# EAGLE design A78 Maxi2 (EAGLE 7.7.0)
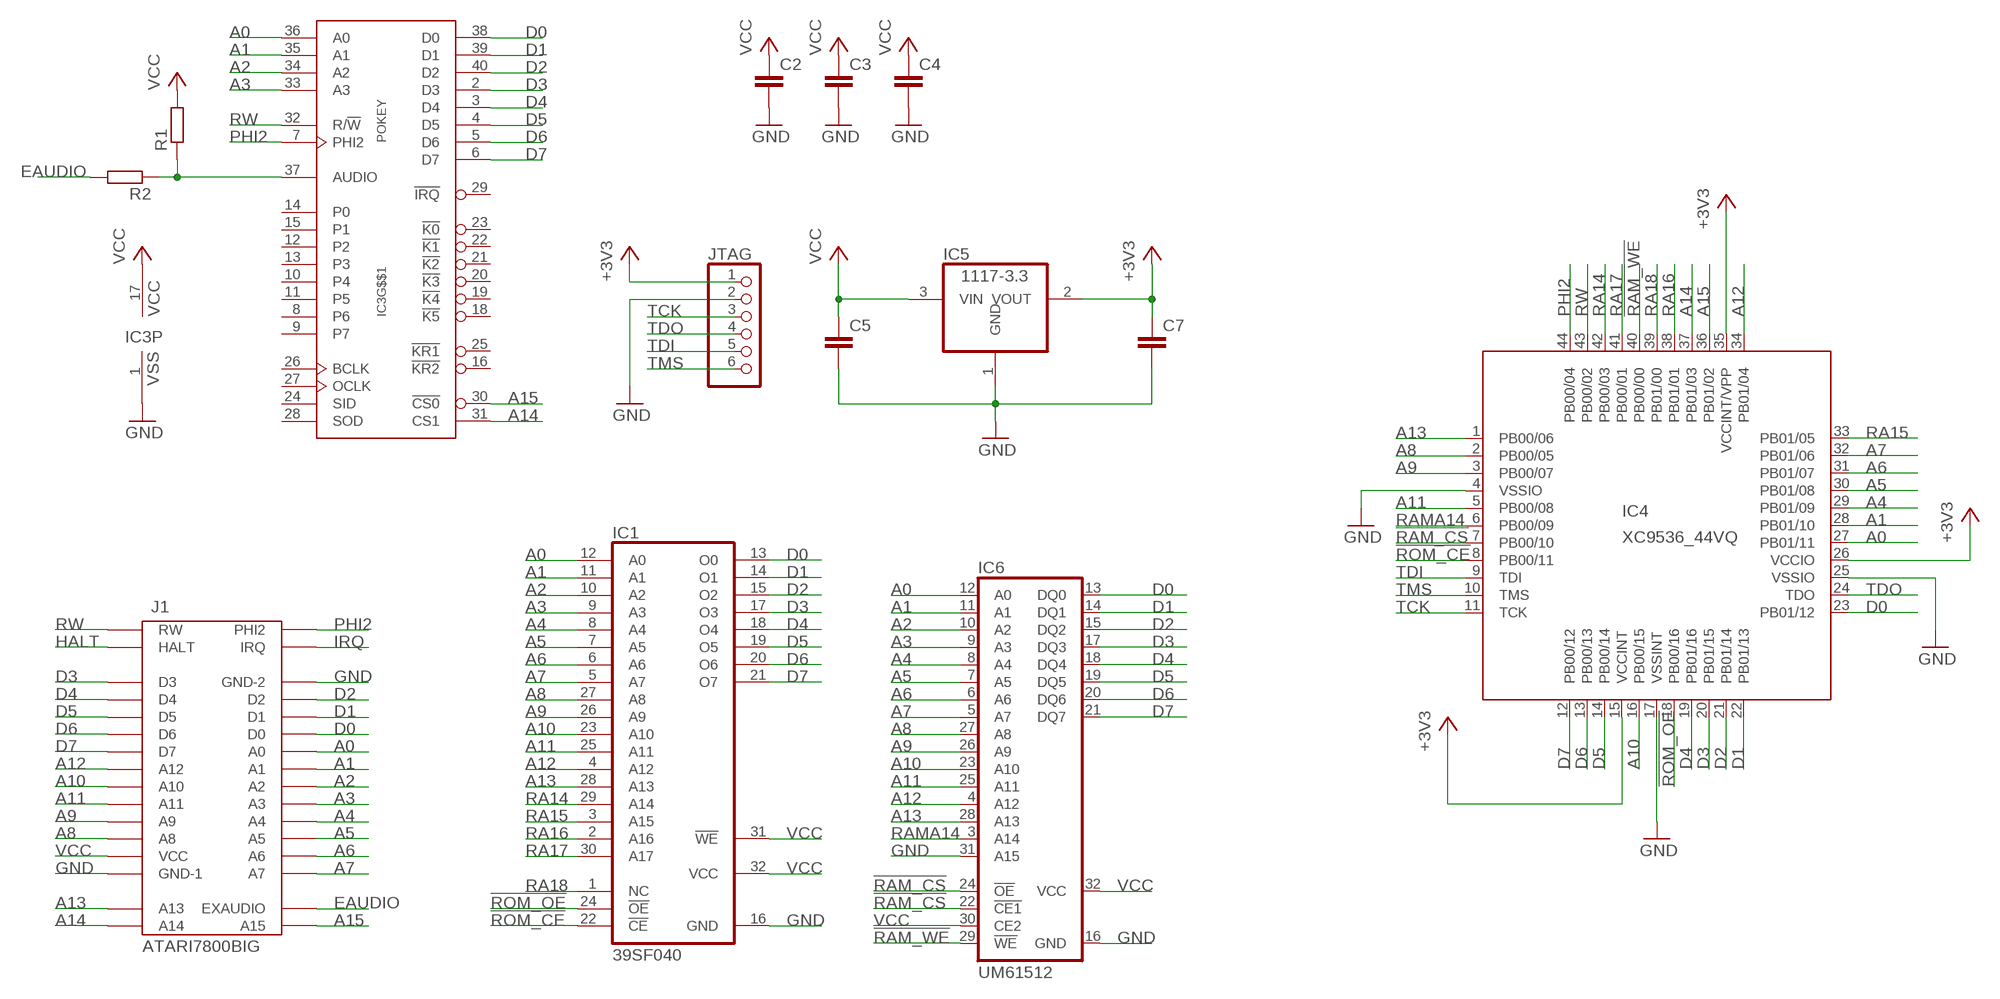
[diagram p0: schematic, sheet 1]

## Parts
C2  C-EU025-025X050  [C025-025X050]
C3  C-EUC0805  [C0805]
C4  C-EUC0805  [C0805]
C5  C-EUC0805  [C0805]
C7  C-EUC0805  [C0805]
IC1  39SF040  39SF020  [DIL32]
IC3  POKEY  [DIL40]
IC4  XC9536_44VQ  [SQFP-S-10X10-44]
IC5  1117-3.3  REG1117  [SOT223]
IC6  UM61512  [DIL32-NARROW]
J1  ATARI7800BIG  [ATARI-7800-BIG]
JTAG  PINHD-1X6  [1X06]
R1  R-EU_R0805  [R0805]
R2  R-EU_R0805  [R0805]

## Nets
!RAM_CS: IC4.7(PB00/10) IC6.22(!CE1) IC6.24(!OE)
!RAM_WE: IC4.40(PB00/00) IC6.29(!WE)
!ROM_CE: IC1.22(!CE) IC4.8(PB00/11)
!ROM_OE: IC1.24(!OE) IC4.18(PB00/16)
+3V3: C7.1 IC4.15(VCCINT) IC4.26(VCCIO) IC4.35(VCCINT/VPP) IC5.2(VOUT) JTAG.1
A0: IC1.12(A0) IC3.36(G$$1:A0) IC4.27(PB01/11) IC6.12(A0) J1.26(A0)
A1: IC1.11(A1) IC3.35(G$$1:A1) IC4.28(PB01/10) IC6.11(A1) J1.25(A1)
A2: IC1.10(A2) IC3.34(G$$1:A2) IC6.10(A2) J1.24(A2)
A3: IC1.9(A3) IC3.33(G$$1:A3) IC6.9(A3) J1.23(A3)
A4: IC1.8(A4) IC4.29(PB01/09) IC6.8(A4) J1.22(A4)
A5: IC1.7(A5) IC4.30(PB01/08) IC6.7(A5) J1.21(A5)
A6: IC1.6(A6) IC4.31(PB01/07) IC6.6(A6) J1.20(A6)
A7: IC1.5(A7) IC4.32(PB01/06) IC6.5(A7) J1.19(A7)
A8: IC1.27(A8) IC4.2(PB00/05) IC6.27(A8) J1.12(A8)
A9: IC1.26(A9) IC4.3(PB00/07) IC6.26(A9) J1.11(A9)
A10: IC1.23(A10) IC4.16(PB00/15) IC6.23(A10) J1.9(A10)
A11: IC1.25(A11) IC4.5(PB00/08) IC6.25(A11) J1.10(A11)
A12: IC1.4(A12) IC4.34(PB01/04) IC6.4(A12) J1.8(A12)
A13: IC1.28(A13) IC4.1(PB00/06) IC6.28(A13) J1.15(A13)
A14: IC3.31(G$$1:CS1) IC4.37(PB01/03) J1.16(A14)
A15: IC3.30(G$$1:!CS0) IC4.36(PB01/02) J1.17(A15)
D0: IC1.13(O0) IC3.38(G$$1:D0) IC4.23(PB01/12) IC6.13(DQ0) J1.27(D0)
D1: IC1.14(O1) IC3.39(G$$1:D1) IC4.22(PB01/13) IC6.14(DQ1) J1.28(D1)
D2: IC1.15(O2) IC3.40(G$$1:D2) IC4.21(PB01/14) IC6.15(DQ2) J1.29(D2)
D3: IC1.17(O3) IC3.2(G$$1:D3) IC4.20(PB01/15) IC6.17(DQ3) J1.3(D3)
D4: IC1.18(O4) IC3.3(G$$1:D4) IC4.19(PB01/16) IC6.18(DQ4) J1.4(D4)
D5: IC1.19(O5) IC3.4(G$$1:D5) IC4.14(PB00/14) IC6.19(DQ5) J1.5(D5)
D6: IC1.20(O6) IC3.5(G$$1:D6) IC4.13(PB00/13) IC6.20(DQ6) J1.6(D6)
D7: IC1.21(O7) IC3.6(G$$1:D7) IC4.12(PB00/12) IC6.21(DQ7) J1.7(D7)
EAUDIO: J1.18(EXAUDIO) R2.2
GND: C2.2 C3.2 C4.2 C5.2 C7.2 IC1.16(GND) IC3.1(P:VSS) IC4.4(VSSIO) IC4.17(VSSINT) IC4.25(VSSIO) IC5.1(GND) IC6.16(GND) IC6.31(A15) J1.14(GND-1) J1.30(GND-2) JTAG.2
HALT: J1.2(HALT)
IRQ: J1.31(IRQ)
N$1: IC3.37(G$$1:AUDIO) R1.1 R2.1
PHI2: IC3.7(G$$1:PHI2) IC4.44(PB00/04) J1.32(PHI2)
RA14: IC1.29(A14) IC4.42(PB00/03)
RA15: IC1.3(A15) IC4.33(PB01/05)
RA16: IC1.2(A16) IC4.38(PB01/01)
RA17: IC1.30(A17) IC4.41(PB00/01)
RA18: IC1.1(NC) IC4.39(PB01/00)
RAMA14: IC4.6(PB00/09) IC6.3(A14)
RW: IC3.32(G$$1:R/!W) IC4.43(PB00/02) J1.1(RW)
TCK: IC4.11(TCK) JTAG.3
TDI: IC4.9(TDI) JTAG.5
TDO: IC4.24(TDO) JTAG.4
TMS: IC4.10(TMS) JTAG.6
VCC: C2.1 C3.1 C4.1 C5.1 IC1.31(!WE) IC1.32(VCC) IC3.17(P:VCC) IC5.3(VIN) IC6.30(CE2) IC6.32(VCC) J1.13(VCC) R1.2
Unconnected: IC3.8(G$$1:P6) IC3.9(G$$1:P7) IC3.10(G$$1:P4) IC3.11(G$$1:P5) IC3.12(G$$1:P2) IC3.13(G$$1:P3) IC3.14(G$$1:P0) IC3.15(G$$1:P1) IC3.16(G$$1:!KR2) IC3.18(G$$1:!K5) IC3.19(G$$1:!K4) IC3.20(G$$1:!K3) IC3.21(G$$1:!K2) IC3.22(G$$1:!K1) IC3.23(G$$1:!K0) IC3.24(G$$1:SID) IC3.25(G$$1:!KR1) IC3.26(G$$1:BCLK) IC3.27(G$$1:OCLK) IC3.28(G$$1:SOD) IC3.29(G$$1:!IRQ)

## Library data of the parts
C2-C5 C7 = rcl:C-EU: CAPACITOR, European symbol
IC1 = 39SF020:39SF020
IC3 = eagle-6.5.0-atari:POKEY: POKEY
IC4 = xilinx-xc9:XC9536_44VQ: xc9536_pc44 XC9500 In-System Programmable CPLD Family Auto generated by make-symbol-device-package-bsdl.ulp Rev. 34 Source: xc9536_vq44.bsd; MPN: XC9536-15VQG44C; OC_FARNELL: 1193227; OC_NEWARK: 98K3377
IC5 = burr-brown:REG1117: 800mA and 1A Low Dropout (LDO) Positive Regulator 1.8V, 2.5V, 2.85V, 3.3V, 5V, and Adj; MPN: REG1117; OC_FARNELL: 1097566; OC_NEWARK: 14P6981
IC6 = eagle-6.5.0-atari:UM61512
J1 = eagle-6.5.0-atari:ATARI7800BIG
JTAG = adafruit:PINHD-1X6: PIN HEADER
R1 R2 = rcl:R-EU_: RESISTOR, European symbol

## Board
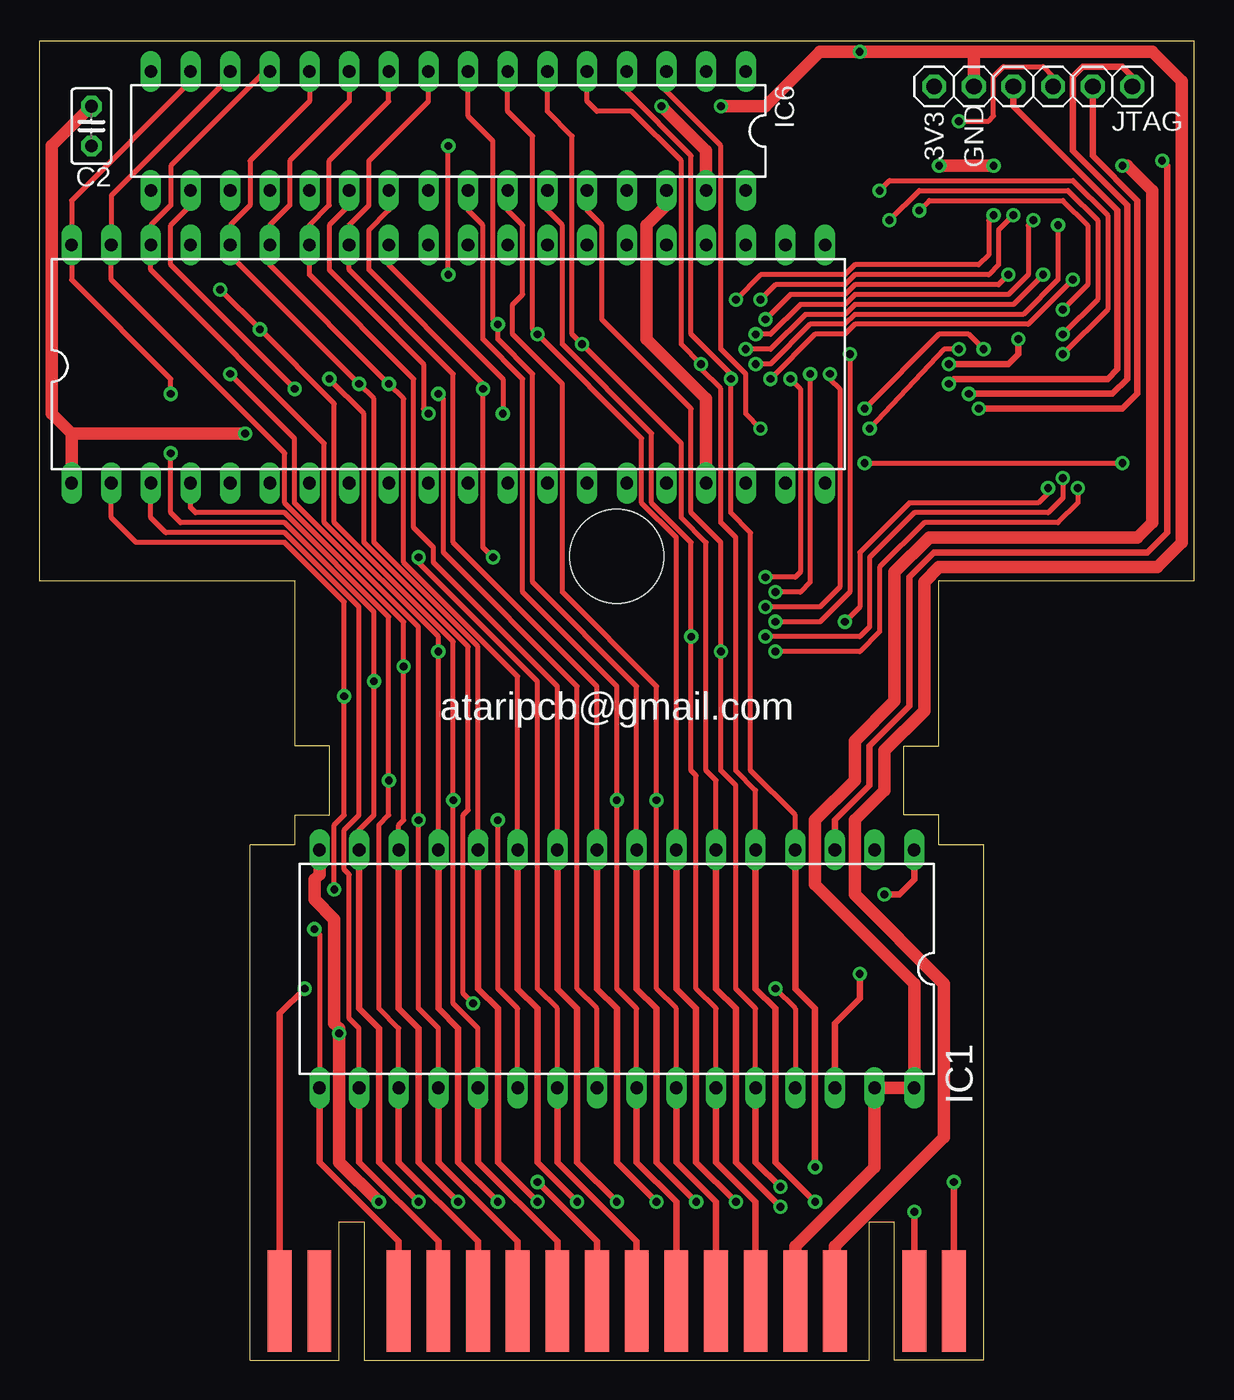
[diagram p1: board, top side]
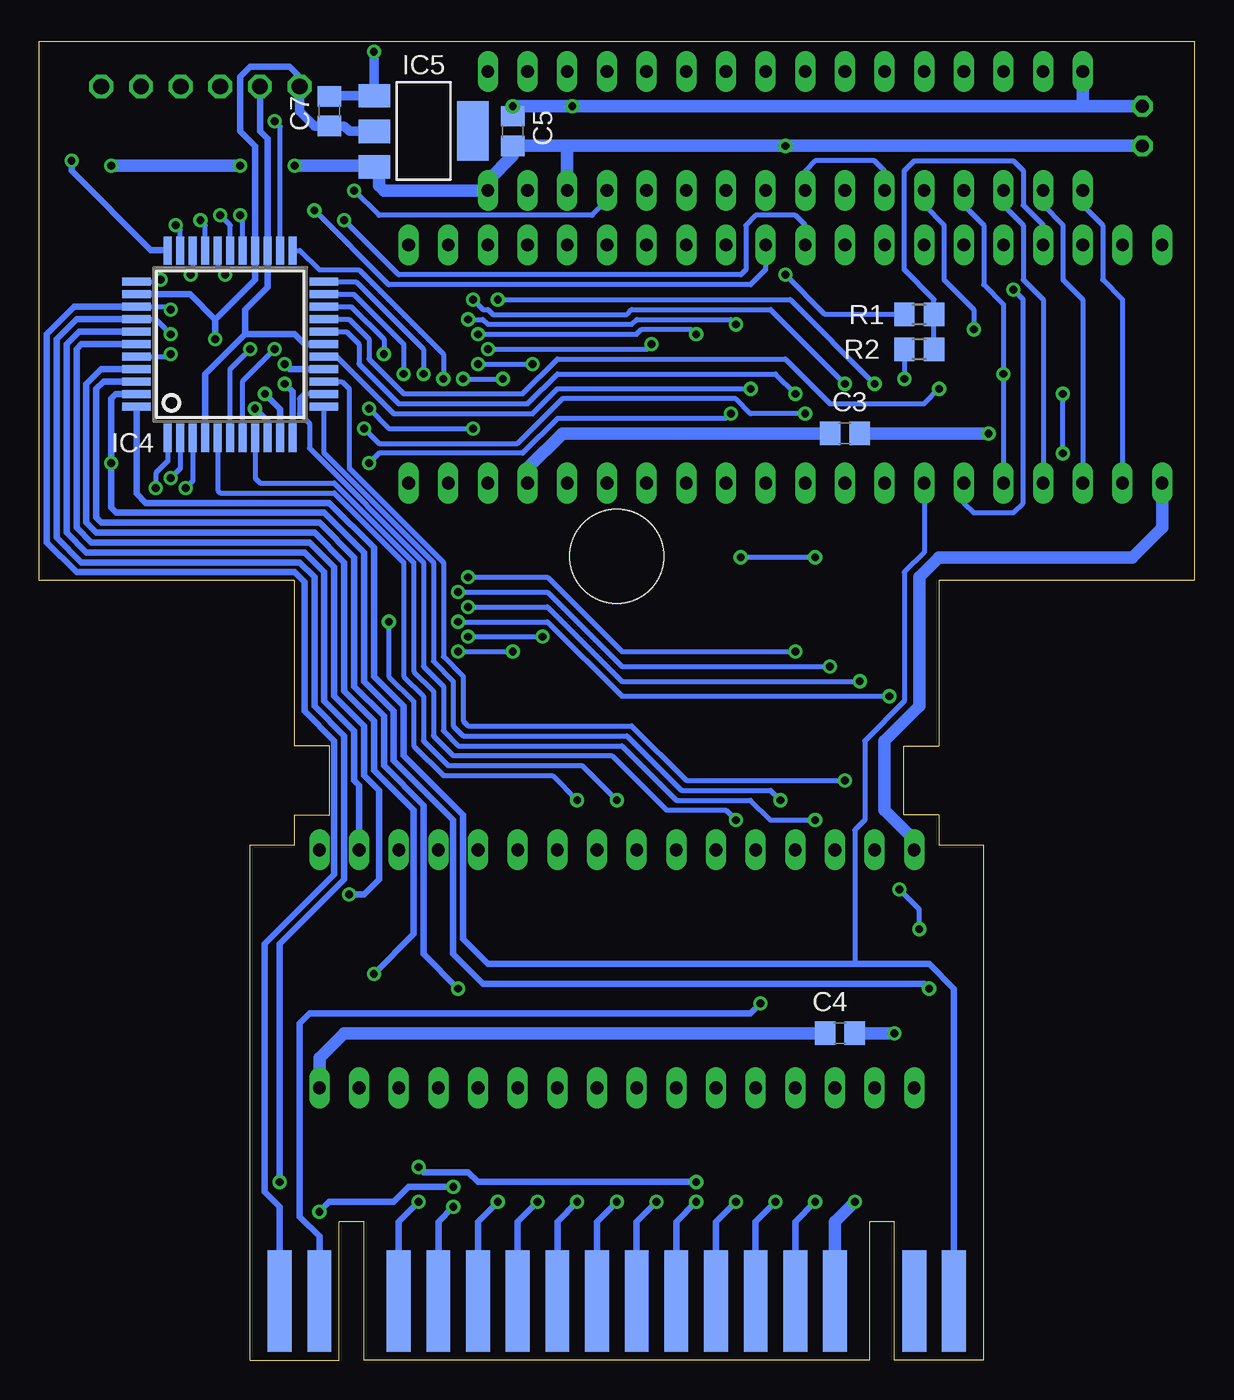
[diagram p2: board, bottom side, seen from below]

Size 74 x 84.5 mm. Coordinates in mm from the lower left corner, seen from the top.
Copper layers (1*16): Top 0.035mm / dielectric 1.5mm / Bottom 0.035mm
Design rules "default": minimum track width 10mil, minimum drill 24mil, track to track 8mil, track to pad 8mil, pad to pad 8mil, via to via 8mil, smd to smd 8mil, copper to edge 40mil, drill to drill 8mil, minimum pad ring 10mil, minimum via ring 8mil, stop-mask expansion 4mil, vias tented up to drill 0mil, thermal gap 10mil

### Footprints (pad centres in the part's own frame; a part is rotated, then mirrored left to right if it is on the bottom)
C025-025X050 = drill 0.813 octagon: 1 -1.27,0; 2 1.27,0
C0805 = smd 1.3 x 1.5: 1 -0.95,0; 2 0.95,0
DIL32 = drill 0.813 long: 1 -19.05,-7.62; 2 -16.51,-7.62; 3 -13.97,-7.62; 4 -11.43,-7.62; 5 -8.89,-7.62; 6 -6.35,-7.62; 7 -3.81,-7.62; 8 -1.27,-7.62; 9 1.27,-7.62; 10 3.81,-7.62; 11 6.35,-7.62; 12 8.89,-7.62; 13 11.43,-7.62; 14 13.97,-7.62; 15 16.51,-7.62; 16 19.05,-7.62; 17 19.05,7.62; 18 16.51,7.62; 19 13.97,7.62; 20 11.43,7.62; 21 8.89,7.62; 22 6.35,7.62; 23 3.81,7.62; 24 1.27,7.62; 25 -1.27,7.62; 26 -3.81,7.62; 27 -6.35,7.62; 28 -8.89,7.62; 29 -11.43,7.62; 30 -13.97,7.62; 31 -16.51,7.62; 32 -19.05,7.62
DIL40 = drill 0.813 long: 1 -24.13,-7.62; 2 -21.59,-7.62; 3 -19.05,-7.62; 4 -16.51,-7.62; 5 -13.97,-7.62; 6 -11.43,-7.62; 7 -8.89,-7.62; 8 -6.35,-7.62; 9 -3.81,-7.62; 10 -1.27,-7.62; 11 1.27,-7.62; 12 3.81,-7.62; 13 6.35,-7.62; 14 8.89,-7.62; 15 11.43,-7.62; 16 13.97,-7.62; 17 16.51,-7.62; 18 19.05,-7.62; 19 21.59,-7.62; 20 24.13,-7.62; 21 24.13,7.62; 22 21.59,7.62; 23 19.05,7.62; 24 16.51,7.62; 25 13.97,7.62; 26 11.43,7.62; 27 8.89,7.62; 28 6.35,7.62; 29 3.81,7.62; 30 1.27,7.62; 31 -1.27,7.62; 32 -3.81,7.62; 33 -6.35,7.62; 34 -8.89,7.62; 35 -11.43,7.62; 36 -13.97,7.62; 37 -16.51,7.62; 38 -19.05,7.62; 39 -21.59,7.62; 40 -24.13,7.62
SQFP-S-10X10-44 = smd 0.5 x 1.8: 1 -4,-6; 2 -3.2,-6; 3 -2.4,-6; 4 -1.6,-6; 5 -0.8,-6; 6 0,-6; 7 0.8,-6; 8 1.6,-6; 9 2.4,-6; 10 3.2,-6; 11 4,-6; 23 4,6; 24 3.2,6; 25 2.4,6; 26 1.6,6; 27 0.8,6; 28 0,6; 29 -0.8,6; 30 -1.6,6; 31 -2.4,6; 32 -3.2,6; 33 -4,6 | smd 1.8 x 0.5: 12 6,-4; 13 6,-3.2; 14 6,-2.4; 15 6,-1.6; 16 6,-0.8; 17 6,0; 18 6,0.8; 19 6,1.6; 20 6,2.4; 21 6,3.2; 22 6,4; 34 -6,4; 35 -6,3.2; 36 -6,2.4; 37 -6,1.6; 38 -6,0.8; 39 -6,0; 40 -6,-0.8; 41 -6,-1.6; 42 -6,-2.4; 43 -6,-3.2; 44 -6,-4
SOT223 = smd 1.499 x 2.007: 1 -2.261,-3.15; 2 0.025,-3.15; 3 2.311,-3.15 | smd 3.81 x 2.007: 4 0,3.15
DIL32-NARROW = drill 0.813 long: 1 -16.51,-3.81; 2 -13.97,-3.81; 3 -11.43,-3.81; 4 -8.89,-3.81; 5 -6.35,-3.81; 6 -3.81,-3.81; 7 -1.27,-3.81; 8 1.27,-3.81; 9 3.81,-3.81; 10 6.35,-3.81; 11 8.89,-3.81; 12 11.43,-3.81; 13 13.97,-3.81; 14 16.51,-3.81; 15 19.05,-3.81; 16 21.59,-3.81; 17 21.59,3.81; 18 19.05,3.81; 19 16.51,3.81; 20 13.97,3.81; 21 11.43,3.81; 22 8.89,3.81; 23 6.35,3.81; 24 3.81,3.81; 25 1.27,3.81; 26 -1.27,3.81; 27 -3.81,3.81; 28 -6.35,3.81; 29 -8.89,3.81; 30 -11.43,3.81; 31 -13.97,3.81; 32 -16.51,3.81
ATARI-7800-BIG = smd 1.524 x 6.477: 1 -21.59,3.81; 2 -19.05,3.81; 3 -13.97,3.81; 4 -11.43,3.81; 5 -8.89,3.81; 6 -6.35,3.81; 7 -3.81,3.81; 8 -1.27,3.81; 9 1.27,3.81; 10 3.81,3.81; 11 6.35,3.81; 12 8.89,3.81; 13 11.43,3.81; 14 13.97,3.81; 15 19.05,3.81; 16 21.59,3.81 | smd 1.524 x 6.477 bottom: 17 21.59,3.81; 18 19.05,3.81; 19 13.97,3.81; 20 11.43,3.81; 21 8.89,3.81; 22 6.35,3.81; 23 3.81,3.81; 24 1.27,3.81; 25 -1.27,3.81; 26 -3.81,3.81; 27 -6.35,3.81; 28 -8.89,3.81; 29 -11.43,3.81; 30 -13.97,3.81; 31 -19.05,3.81; 32 -21.59,3.81 | hole 6: 0,51.5
1X06 = drill 1.016 octagon: 1 -6.35,0; 2 -3.81,0; 3 -1.27,0; 4 1.27,0; 5 3.81,0; 6 6.35,0
R0805 = smd 1.3 x 1.5: 1 -0.95,0; 2 0.95,0

### Placement (x,y rotation side)
C2  3.34,79.06 90 top
C3  22.39,59.37 0 bottom
C4  22.71,20.96 0 bottom
C5  43.67,78.74 90 bottom
C7  55.41,80.01 90 bottom
IC1  37,25.08 180 top
IC3  26.2,63.82 0 top
IC4  61.77,65.09 0 bottom
IC5  49.38,78.74 270 bottom
IC6  28.74,78.74 180 top
J1  37,0 0 top
JTAG  63.67,81.6 0 top
R1  17.63,66.99 180 bottom
R2  17.63,64.77 180 bottom

### Tracks (layer width: path | path; a pad name or v marks a point on that pad's centre or on a via)
!RAM_CS  (via drill 0.5)
  Top 0.305: v58.91,64.77 57.95,64.77 v53.19,59.69 | IC6.22 19.86,73.98 18.59,72.71 18.59,69.85 24.62,63.82 24.62,60.96 v24.94,60.64
  Bottom 0.305: IC4.7 60.97,62.71 v58.91,64.77 | v53.19,59.69 52.24,58.74 43.35,58.74 40.49,61.59 29.38,61.59 28.43,60.64 v24.94,60.64 | IC6.22 19.86,76.2 20.49,76.84 24.3,76.84 24.94,76.2 IC6.24
!RAM_WE  (via drill 0.5)
  Top 0.305: v53.83,74.93 54.46,75.56 66.21,75.56 68.43,73.34 68.43,67.31 v65.58,64.45
  Bottom 0.305: IC6.29 37.63,74.3 38.59,73.34 52.24,73.34 v53.83,74.93 | IC4.40 65.74,64.29 v65.58,64.45
!ROM_CE  (via drill 0.5)
  Top 0.305: IC1.22 30.65,22.54 29.38,23.81 v29.38,34.61
  Bottom 0.305: IC4.8 60.16,56.5 59.86,56.2 55.1,56.2 50.02,51.12 50.02,44.13 48.75,42.86 48.75,40 47.48,38.73 37.32,38.73 33.83,35.24 30.02,35.24 v29.38,34.61
!ROM_OE  (via drill 0.5)
  Top 0.305: IC1.24 35.73,22.54 34.46,23.81 34.46,43.18 25.89,51.75 25.89,61.59 v25.57,61.91
  Bottom 0.305: IC4.18 54.31,65.89 53.51,65.09 53.51,63.82 50.97,61.28 42.72,61.28 40.81,63.18 26.84,63.18 v25.57,61.91
+3V3  (via drill 0.5)
  Top 0.406: v58.27,63.82 62.08,63.82 62.72,64.45 v62.72,65.41
  Bottom 0.406: IC4.15 57.95,63.5 58.26,63.8 | 58.26,63.8 58.28,63.8 v58.27,63.82 58.26,63.8 | v62.72,65.41 62.72,66.67 | 62.72,66.67 60.18,69.22 60.18,71.08 IC4.26 60.16,77.78 61.13,78.74 61.13,82.23 60.5,82.87 57.95,82.87 57.32,82.23 JTAG.1 | IC4.35 64.33,68.29 62.72,66.67
  Bottom 0.61: IC5.2 54.12,78.72 54.46,79.06 C7.1 56.37,79.06 57.32,80.01 JTAG.1
A0  (via drill 0.5)
  Top 0.305: IC1.12 28.11,45.72 21.44,52.39 21.44,61.59 v20.49,62.55 12.23,70.8 IC3.36 12.23,72.71 13.5,73.98 13.5,76.84 17.32,80.65 IC6.12 | v61.13,73.34 60.81,73.03 60.81,70.8 60.18,70.17 52.24,70.17 51.61,69.53 46.21,69.53 v44.62,67.95
  Top 0.406: v31.92,10.16 29.38,12.7 29.38,22.54 28.11,23.81 IC1.12
  Bottom 0.305: IC4.27 60.97,73.18 v61.13,73.34 | v44.62,67.95 25.89,67.95 v20.49,62.55
  Bottom 0.406: J1.26 33.19,8.89 v31.92,10.16
A1  (via drill 0.5)
  Top 0.305: IC1.11 30.65,43.81 23.35,51.12 23.35,61.59 v22.39,62.55 14.77,70.17 IC3.35 14.77,72.71 16.05,73.98 16.05,76.84 19.86,80.65 IC6.11 | v46.21,67.95 47.16,68.9 51.61,68.9 52.24,69.53 60.81,69.53 61.45,70.17 61.45,72.39 v62.4,73.34
  Top 0.406: v34.46,10.16 31.92,12.7 31.92,22.54 30.65,23.81 IC1.11
  Bottom 0.305: IC4.28 61.77,72.71 v62.4,73.34 | v46.21,67.95 45.57,67.31 45.26,67.31 44.94,66.99 36.37,66.99 36.05,67.31 27.16,67.31 v22.39,62.55
  Bottom 0.406: J1.25 35.73,8.89 v34.46,10.16
A2  (via drill 0.5)
  Top 0.305: IC1.10 33.19,43.18 25.25,51.12 25.25,52.07 23.98,53.34 23.98,62.87 17.32,69.53 IC3.34 17.32,72.71 18.59,73.98 18.59,76.84 22.39,80.65 IC6.10
  Top 0.406: v37,10.16 34.46,12.7 34.46,22.54 33.19,23.81 IC1.10
  Bottom 0.406: J1.24 38.27,8.89 v37,10.16
A3  (via drill 0.5)
  Top 0.305: IC1.9 35.73,43.18 26.52,52.39 26.52,63.18 19.86,69.85 IC3.33 19.86,72.71 21.12,73.98 21.12,76.84 24.94,80.65 IC6.9
  Top 0.406: v39.54,10.16 37,12.7 37,22.54 35.73,23.81 IC1.9
  Bottom 0.406: J1.23 40.81,8.89 v39.54,10.16
A4  (via drill 0.5)
  Top 0.305: IC1.8 38.27,43.18 31.6,49.85 31.6,63.18 29.38,65.41 v29.38,66.36 29.06,66.67 29.06,78.11 27.48,79.69 IC6.8 | v62.08,69.53 61.45,68.9 52.24,68.9 51.61,68.26 48.11,68.26 v46.52,66.67
  Top 0.406: v42.08,10.16 39.54,12.7 39.54,22.54 38.27,23.81 IC1.8
  Bottom 0.305: IC4.29 62.56,70.02 v62.08,69.53 | v46.52,66.67 45.57,66.67 45.26,66.36 36.05,66.36 35.73,66.67 29.7,66.67 v29.38,66.36
  Bottom 0.406: J1.22 43.35,8.89 v42.08,10.16
A5  (via drill 0.5)
  Top 0.305: IC1.7 40.81,52.7 38.59,54.93 38.59,59.05 v31.92,65.72 31.6,66.04 31.6,78.42 30.02,80.01 IC6.7 | v63.67,73.03 63.35,72.71 63.35,69.53 62.08,68.26 52.24,68.26 51.61,67.63 48.75,67.63 46.84,65.72 v45.89,65.72
  Top 0.406: v44.62,10.16 42.08,12.7 42.08,22.54 40.81,23.81 IC1.7
  Bottom 0.305: IC4.30 63.36,72.7 v63.67,73.03 | v45.89,65.72 35.73,65.72 35.41,66.04 32.24,66.04 v31.92,65.72
  Bottom 0.406: J1.21 45.89,8.89 v44.62,10.16
A6  (via drill 0.5)
  Top 0.305: IC1.6 43.35,37.15 42.72,37.78 42.72,52.39 41.13,53.97 41.13,58.74 v34.78,65.09 34.14,65.72 34.14,78.42 32.55,80.01 IC6.6 | v45.26,64.77 46.84,64.77 49.06,66.99 51.61,66.99 52.24,67.63 62.4,67.63 v64.31,69.53
  Top 0.406: v47.48,9.84 44.62,12.7 44.62,22.54 43.35,23.81 IC1.6
  Bottom 0.305: IC4.31 64.16,69.67 v64.31,69.53 | v45.26,64.77 35.09,64.77 v34.78,65.09
  Bottom 0.406: J1.20 48.43,8.89 v47.48,9.84
A7  (via drill 0.5)
  Top 0.305: IC1.5 45.89,36.51 44.62,37.78 44.62,52.7 43.67,53.66 43.67,62.23 42.4,63.5 v42.4,63.82 41.13,65.09 41.13,76.84 37.95,80.01 35.73,80.01 35.09,80.65 IC6.5 | v45.89,63.82 46.84,63.82 49.38,66.36 51.61,66.36 52.24,66.99 63.03,66.99 65.26,69.22 v65.26,72.71
  Top 0.406: v49.7,10.16 47.16,12.7 47.16,22.54 45.89,23.81 IC1.5
  Bottom 0.305: IC4.32 64.97,72.42 v65.26,72.71 | v45.89,63.82 v42.4,63.82
  Bottom 0.406: J1.19 50.97,8.89 v49.7,10.16
A8  (via drill 0.5)
  Top 0.305: IC1.27 43.35,22.54 42.08,23.81 42.08,37.46 41.76,37.78 v41.76,46.35 41.76,52.39 39.22,54.93 39.22,59.37 33.51,65.09 33.51,72.71 32.55,73.66 IC6.27 | v65.58,56.51 65.58,55.24 64.62,54.29 56.05,54.29 53.19,51.43 53.19,46.99 52.56,46.35 v46.52,46.35
  Top 0.406: J1.12 45.89,10.16 43.35,12.7 IC1.27
  Bottom 0.305: IC4.2 64.97,57.12 v65.58,56.51 | v46.52,46.35 v41.76,46.35
A9  (via drill 0.5)
  Top 0.305: IC1.26 40.81,22.54 39.54,23.81 v39.54,35.88 39.54,43.18 33.51,49.21 33.51,62.55 30.33,65.72 30.33,67.63 30.97,68.26 30.97,72.71 30.02,73.66 IC6.26 | v64.62,55.88 64.62,55.56 63.99,54.93 55.73,54.93 52.56,51.75 52.56,48.26 v51.61,47.31
  Top 0.406: J1.11 43.35,10.16 40.81,12.7 IC1.26
  Bottom 0.305: IC4.3 64.16,56.34 v64.62,55.88 | v51.61,47.31 51.61,43.81 50.02,42.23 50.02,39.37 48.11,37.46 41.13,37.46 v39.54,35.88
A10  (via drill 0.5)
  Top 0.305: IC1.23 33.19,22.54 31.92,23.81 31.92,43.5 24.3,51.12 v24.3,51.43 | v29.06,51.43 28.43,52.07 v28.43,62.23 28.43,62.55 21.12,69.85 21.12,72.39 22.39,73.66 IC6.23
  Top 0.406: J1.9 38.27,7.62 33.19,12.7 IC1.23
  Bottom 0.305: v24.3,51.43 v29.06,51.43 | IC4.16 54.93,64.29 51.29,60.64 42.4,60.64 40.81,62.23 v28.43,62.23
A11  (via drill 0.5)
  Top 0.305: IC1.25 38.27,22.54 37,23.81 v37,35.88 37,43.18 30.97,49.21 30.97,62.87 28.43,65.41 28.43,72.71 27.48,73.66 IC6.25
  Top 0.406: J1.10 40.81,10.16 38.27,12.7 IC1.25
  Bottom 0.305: IC4.5 62.56,55.73 62.4,55.56 55.1,55.56 50.65,51.12 50.65,43.81 49.38,42.54 49.38,39.69 47.8,38.1 39.22,38.1 v37,35.88
A12  (via drill 0.5)
  Top 0.305: IC6.4 37.63,81.28 41.76,77.15 41.76,65.72 44.3,63.18 v44.3,62.87 44.3,54.29 45.57,53.02 45.57,37.78 48.43,34.92 IC1.4 | v66.21,69.22 63.35,66.36 52.24,66.36 51.61,65.72 49.7,65.72 v46.84,62.87
  Top 0.406: J1.8 35.73,7.62 v31.92,11.43 | v49.7,12.38 49.7,22.54 48.43,23.81 IC1.4
  Bottom 0.305: IC4.34 66.34,69.09 v66.21,69.22 | v46.84,62.87 v44.3,62.87
  Bottom 0.406: v31.92,11.43 45.89,11.43 46.52,12.07 49.38,12.07 v49.7,12.38
A13  (via drill 0.5)
  Top 0.305: IC1.28 45.89,22.54 44.62,23.81 44.62,36.83 43.67,37.78 v43.67,45.4 43.67,52.39 41.76,54.29 41.76,60.96 36.05,66.67 36.05,72.71 35.09,73.66 IC6.28 | v66.53,55.88 66.53,54.93 65.26,53.66 56.69,53.66 53.83,50.8 53.83,46.67 52.56,45.4 v47.16,45.4
  Top 0.406: J1.15 v56.05,9.53 | v47.48,11.11 45.89,12.7 IC1.28
  Bottom 0.305: IC4.1 65.77,57.59 66.53,56.83 v66.53,55.88 | v47.16,45.4 v43.67,45.4
  Bottom 0.406: v56.05,9.53 55.41,10.16 51.29,10.16 50.34,11.11 v47.48,11.11
A14  (via drill 0.5)
  Top 0.305: v54.46,73.03 56.37,74.93 65.89,74.93 67.8,73.03 67.8,67.95 v65.58,65.72
  Top 0.406: J1.16 v58.59,11.43
  Bottom 0.305: IC3.31 24.94,72.71 25.57,73.34 28.11,73.34 28.74,72.71 28.74,69.85 29.06,69.53 50.97,69.53 v54.46,73.03 | IC4.37 66.54,66.69 v65.58,65.72
  Bottom 0.406: v58.59,11.43 58.59,26.67 54.46,30.8 54.46,40 56.37,41.91 56.37,50.16 57.32,51.12 71.29,51.12 72.88,52.7 72.88,65.41 71.59,66.69 IC4.37
A15  (via drill 0.5)
  Top 0.305: v56.37,73.66 57,74.3 65.58,74.3 67.16,72.71 67.16,68.9 v65.58,67.31
  Bottom 0.305: IC3.30 27.48,69.85 28.43,68.9 51.61,68.9 v56.37,73.66 | IC4.36 65.75,67.49 v65.58,67.31
  Bottom 0.406: J1.17 58.59,9.84 59.54,10.79 59.54,26.67 55.1,31.11 55.1,39.69 57,41.59 57,49.85 57.64,50.48 71.61,50.48 73.51,52.39 73.51,65.72 71.75,67.49 IC4.36
D0  (via drill 0.5)
  Top 0.305: IC1.13 v25.57,45.4 25.57,46.35 18.27,53.66 18.27,58.74 7.16,69.85 IC3.38 7.16,72.71 8.43,73.98 8.43,76.52 14.46,82.55 IC6.13 | v48.11,62.87 48.75,62.23 48.75,50.48 48.43,50.16 v46.52,50.16
  Top 0.406: v29.38,10.16 26.84,12.7 26.84,21.27 25.57,22.54 IC1.13
  Bottom 0.305: IC4.23 57.29,71.09 56.05,69.85 53.51,69.85 48.11,64.45 v48.11,62.87 | v46.52,50.16 41.45,50.16 36.68,45.4 v25.57,45.4
  Bottom 0.406: J1.27 30.65,8.89 v29.38,10.16
D1  (via drill 0.5)
  Top 0.305: IC1.14 23.03,34.29 23.35,34.61 v23.35,44.45 23.35,47.31 15.73,54.93 15.73,58.1 4.62,69.22 IC3.39 4.62,74.61 12.23,82.23 IC6.14 | v49.38,63.18 49.38,49.85 48.75,49.21 v47.16,49.21
  Top 0.406: v26.84,10.16 24.3,12.7 24.3,21.27 23.03,22.54 IC1.14
  Bottom 0.305: IC4.22 53.7,69.09 49.38,64.77 v49.38,63.18 | v47.16,49.21 41.45,49.21 36.68,44.45 v23.35,44.45
  Bottom 0.406: J1.28 28.11,8.89 v26.84,10.16
D2  (via drill 0.5)
  Top 0.305: IC1.15 20.49,33.97 21.44,34.92 v21.44,43.5 21.44,47.94 15.73,53.66 9.06,53.66 8.43,54.29 v8.43,58.1 | IC6.15 9.7,81.92 2.08,74.3 IC3.40 2.08,69.22 8.43,62.87 v8.43,61.91 | v50.65,63.18 50.65,62.87 51.29,62.23 51.29,49.53 50.02,48.26 v46.52,48.26
  Top 0.406: v24.3,10.16 21.76,12.7 21.76,21.27 20.49,22.54 IC1.15
  Bottom 0.305: IC4.21 53.85,68.29 50.65,65.09 v50.65,63.18 | v46.52,48.26 41.45,48.26 36.68,43.5 v21.44,43.5 | v8.43,58.1 v8.43,61.91
  Bottom 0.406: J1.29 25.57,8.89 v24.3,10.16
D3  (via drill 0.5)
  Top 0.305: v18.9,30.16 18.9,34.29 19.54,34.92 v19.54,42.54 19.54,48.58 15.73,52.39 6.2,52.39 4.62,53.97 IC3.2 | v17.63,27.62 17.95,27.3 IC1.17 | v51.92,64.45 51.92,49.21 50.02,47.31 v47.16,47.31
  Top 0.406: J1.3 23.03,7.62 17.95,12.7 IC1.17
  Bottom 0.305: v17.63,27.62 17.63,28.89 v18.9,30.16 | IC6.17 7.16,73.98 5.89,72.71 5.89,69.22 4.62,67.95 IC3.2 | IC4.20 54,67.49 51.92,65.41 v51.92,64.45 | v47.16,47.31 41.45,47.31 36.68,42.54 v19.54,42.54
D4  (via drill 0.5)
  Top 0.305: IC1.18 20.49,21.27 19.86,21.91 19.86,31.11 19.54,31.43 19.54,33.97 20.49,34.92 20.49,48.26 15.73,53.02 8.11,53.02 7.16,53.97 IC3.3 | v16.36,62.23 8.43,70.17 8.43,72.71 9.7,73.98 IC6.18
  Top 0.406: J1.4 25.57,7.62 20.49,12.7 IC1.18
  Bottom 0.305: IC6.18 9.7,73.98 8.43,72.71 8.43,69.22 7.16,67.95 IC3.3 | IC4.19 54.16,66.69 52.88,65.41 52.88,64.14 50.65,61.91 43.03,61.91 40.81,64.14 26.2,64.14 23.35,61.28 17.32,61.28 v16.36,62.23
D5  (via drill 0.5)
  Top 0.305: IC1.19 23.03,21.27 21.76,22.54 21.76,34.29 22.39,34.92 v22.39,37.15 22.39,47.62 15.73,54.29 10.01,54.29 9.7,54.61 IC3.4
  Top 0.406: J1.5 28.11,7.62 23.03,12.7 IC1.19
  Bottom 0.305: IC6.19 12.23,73.98 10.96,72.71 10.96,69.22 9.7,67.95 IC3.4 | IC4.14 54.6,62.69 54.14,62.23 54.14,57.15 48.11,51.12 48.11,45.08 46.84,43.81 46.84,40.96 46.52,40.64 36.05,40.64 32.55,37.15 v22.39,37.15
D6  (via drill 0.5)
  Top 0.305: IC1.20 25.57,21.27 24.3,22.54 v24.3,34.61 24.3,46.99 16.36,54.93 16.36,59.05 v12.23,63.18
  Top 0.406: J1.6 30.65,7.62 25.57,12.7 IC1.20
  Bottom 0.305: IC6.20 14.77,73.98 13.5,72.71 13.5,68.9 12.23,67.63 v12.23,63.18 IC3.5 | IC4.13 57.03,61.89 57.32,61.59 57.32,60.64 56.69,60.01 56.69,58.42 49.38,51.12 49.38,44.45 48.11,43.18 48.11,40.32 47.16,39.37 36.68,39.37 33.19,35.88 28.43,35.88 27.16,34.61 v24.3,34.61
D7  (via drill 0.5)
  Top 0.305: IC1.21 28.11,21.27 26.52,22.86 v26.52,35.88 26.52,46.04 18.9,53.66 18.9,61.28 v14.14,66.04 v11.6,68.58
  Top 0.406: J1.7 33.19,7.62 28.11,12.7 IC1.21
  Bottom 0.305: IC6.21 17.32,73.98 16.05,72.71 16.05,69.22 14.14,67.31 v14.14,66.04 | IC4.12 55.77,58.13 48.75,51.12 48.75,44.77 47.48,43.5 47.48,40.64 46.84,40 36.37,40 32.87,36.51 27.16,36.51 v26.52,35.88 | IC3.6 14.77,54.93 14.14,54.29 11.6,54.29 10.96,54.93 10.96,67.95 v11.6,68.58
EAUDIO  (via drill 0.5)
  Top 0.305: v27.79,22.86 27.16,23.5 27.16,34.92 27.48,35.24 27.48,45.72 20.81,52.39 20.81,60.64 v18.59,62.87
  Bottom 0.305: R2.2 v18.58,62.87 v18.59,62.87
  Bottom 0.406: J1.18 56.05,7.94 57.32,9.21 57.32,21.59 56.69,22.23 28.43,22.23 v27.79,22.86
GND  (via drill 0.5)
  Top 0.813: v21.76,10.16 19.22,12.7 v19.22,20.96 19.22,21.27 18.9,21.59 18.9,28.26 17.63,29.53 17.63,30.8 17.95,31.11 IC1.16 | J1.14 50.97,7.3 57.95,14.29 57.95,24.13 52.24,29.84 52.24,34.61 54.14,36.51 54.14,39.05 56.69,41.59 56.69,49.85 57.64,50.8 71.61,50.8 73.19,52.39 73.19,81.92 71.29,83.82 59.86,83.82 | 59.86,83.82 v52.56,83.82 50.02,83.82 46.52,80.33 v43.67,80.33 | C2.2 0.8,77.79 0.8,60.64 2.08,59.37 | JTAG.2 59.86,83.82 | v39.86,80.33 42.72,77.47 IC6.31 | 2.08,59.37 IC3.1 | v13.19,59.37 2.08,59.37
  Bottom 0.406: IC4.17 57,65.09 57.64,65.72 60.81,65.72 | 60.81,65.72 60.81,67.31 59.36,68.76 IC4.25 59.36,78.25 59.86,78.74 JTAG.2 | IC4.4 63.36,63.17 60.81,65.72
  Bottom 0.61: C7.2 55.37,81 IC5.1 52.53,83.48 v52.56,83.82
  Bottom 0.813: J1.30 23.03,8.89 v21.76,10.16 | C4.2 v19.22,20.96 | C2.2 7.16,80.33 | 7.16,80.33 v39.86,80.33 v43.67,80.33 C5.2 | IC6.16 7.16,80.33 | C3.2 v13.19,59.37 | IC1.16 17.95,33.34 19.86,35.24 19.86,39.69 17.63,41.91 17.63,50.16 16.36,51.43 3.98,51.43 2.08,53.34 IC3.1
N$1
  Bottom 0.305: R2.1 R1.1 16.68,67.95 18.59,69.85 18.59,76.2 17.95,76.84 11.6,76.84 10.96,76.2 10.96,73.98 9.7,72.71 IC3.37
PHI2
  Bottom 0.305: IC3.7 17.32,51.75 18.59,50.48 18.59,42.23 21.12,39.69 21.12,34.61 21.76,33.97 21.76,25.4
  Bottom 0.406: IC4.44 67.77,55.53 67.16,54.93 55.41,54.93 52.56,52.07 52.56,43.81 50.65,41.91 50.65,38.73 46.84,34.92 46.84,26.99 45.26,25.4 21.76,25.4 17,25.4 15.41,23.81 J1.32
RA14  (via drill 0.5)
  Top 0.305: v47.16,23.81 48.43,22.54 IC1.29
  Bottom 0.406: v47.16,23.81 49.38,26.04 49.38,35.56 51.92,38.1 51.92,41.27 53.83,43.18 53.83,51.43 56.05,53.66 70.02,53.66 70.34,53.97 70.34,62.23 69.88,62.69 IC4.42
RA15  (via drill 0.5)
  Top 0.406: IC1.3 50.97,34.61 53.19,36.83 53.19,39.37 55.73,41.91 55.73,50.16 57.32,51.75 70.97,51.75 72.24,53.02 72.24,76.52 v71.92,76.84
  Bottom 0.406: v71.92,76.84 71.92,76.2 66.84,71.12 65.8,71.12 IC4.33
RA16
  Bottom 0.406: IC1.2 53.51,36.83 53.83,37.15 53.83,40.32 55.73,42.23 55.73,50.48 57,51.75 70.97,51.75 72.24,53.02 72.24,65.09 71.44,65.89 IC4.38
RA17  (via drill 0.5)
  Top 0.406: IC1.30 50.97,21.59 52.56,23.18 v52.56,24.77
  Bottom 0.406: v52.56,24.77 50.02,27.3 50.02,35.24 52.56,37.78 52.56,40.96 54.46,42.86 54.46,51.12 56.37,53.02 70.34,53.02 70.97,53.66 70.97,62.55 70.03,63.49 IC4.41
RA18  (via drill 0.5)
  Top 0.406: IC1.1 56.05,30.8 55.1,29.84 v54.14,29.84
  Bottom 0.406: IC4.39 71.29,65.09 71.61,64.77 71.61,53.34 70.66,52.39 56.69,52.39 55.1,50.8 55.1,42.54 53.19,40.64 53.19,37.46 52.24,36.51 52.24,30.8 53.19,29.84 v54.14,29.84
RAMA14  (via drill 0.5)
  Top 0.305: v60.5,64.77 59.54,65.72 57.64,65.72 v52.88,60.96 | v46.21,59.69 45.26,60.64 45.26,63.18 43.67,64.77 43.67,77.79 40.17,81.28 IC6.3
  Bottom 0.305: IC4.6 61.77,63.5 v60.5,64.77 | v52.88,60.96 51.61,59.69 v46.21,59.69
RW  (via drill 0.5)
  Top 0.305: IC3.32 22.39,70.17 29.7,62.87 v29.7,60.64 | v52.88,57.47 v69.38,57.47
  Top 0.406: J1.1 15.41,22.23 v17,23.81
  Bottom 0.305: v29.7,60.64 30.02,60.32 40.81,60.32 43.03,58.1 52.24,58.1 v52.88,57.47
  Bottom 0.406: v17,23.81 17.32,24.13 45.57,24.13 47.48,26.04 47.48,34.61 51.29,38.42 51.29,41.59 53.19,43.5 53.19,51.75 55.73,54.29 69.07,54.29 69.38,54.61 v69.38,57.47 69.38,61.59 69.09,61.89 IC4.43
TCK  (via drill 0.5)
  Top 0.406: v58.27,62.55 58.59,62.87 68.43,62.87 69.07,63.5 69.07,73.66 62.4,80.33 JTAG.3
  Bottom 0.406: IC4.11 57.77,62.04 v58.27,62.55
TDI  (via drill 0.5)
  Top 0.406: v60.18,60.96 69.38,60.96 70.34,61.91 70.34,74.3 67.48,77.15 JTAG.5
  Bottom 0.406: IC4.9 59.36,60.15 v60.18,60.96
TDO  (via drill 0.5)
  Top 0.305: v58.91,79.38 60.81,79.38 61.13,79.69 61.13,82.23 61.77,82.87 64.31,82.87 64.94,82.23 JTAG.4
  Bottom 0.305: IC4.24 58.56,79.03 v58.91,79.38
TMS  (via drill 0.5)
  Top 0.406: v59.54,61.91 68.75,61.91 69.7,62.87 69.7,73.98 66.21,77.47 66.21,82.23 66.84,82.87 69.38,82.87 70.02,82.23 JTAG.6
  Bottom 0.406: IC4.10 58.56,60.93 v59.54,61.91
VCC  (via drill 0.5)
  Top 0.305: v26.2,69.53 v26.2,77.79
  Top 0.813: J1.13 48.43,7.3 53.51,12.38 IC1.31 IC1.32 56.05,24.13 49.7,30.48 49.7,34.61 52.24,37.15 52.24,39.69 54.78,42.23 54.78,50.48 57,52.7 70.34,52.7 71.29,53.66 71.29,74.93 69.7,76.52 v69.38,76.52 | IC6.30 40.17,73.98 38.91,72.71 38.91,65.41 42.72,61.59 IC3.17 | v57.64,76.52 v61.13,76.52
  Bottom 0.305: R1.2 23.66,66.99 v26.2,69.53 | v26.2,77.79 26.2,77.47 26.52,77.79
  Bottom 0.813: C4.1 54.46,20.96 56.05,19.37 IC1.32 | v57.64,76.52 52.62,76.52 IC5.3 52.24,76.4 52.24,75.25 51.92,74.93 IC6.32 45.26,75.56 43.67,77.15 C5.1 40.17,77.79 | v61.13,76.52 v69.38,76.52 | 40.17,77.79 26.52,77.79 6.84,77.79 C2.1 | IC6.30 40.17,77.79 | C3.1 40.49,59.37 42.72,57.15 IC3.17

### Text on the board
tNames: 3V3 | GND | ataripcb@gmail.com